# Altium schematic sheet SMPS_LLC.SchDoc
size A3; CheckedBy: Alain.Zhu; CompanyName: TYMPHANY; DrawnBy: Yetta.He; Organization: PABU-BL3; Address1: 11F,block A, CEC building,; Address2: No.2070 Shennan Zhong road,; Address3: Huaqiang North, Futian District,; Address4: Shenzhen,  Guang Dong, P.R.C 518000; DocumentNumber: 3; Revision: 1.0.0; SheetNumber: 3; SheetTotal: 8; Size: A3; PCB By: Yetta.He; Status: DP1.1
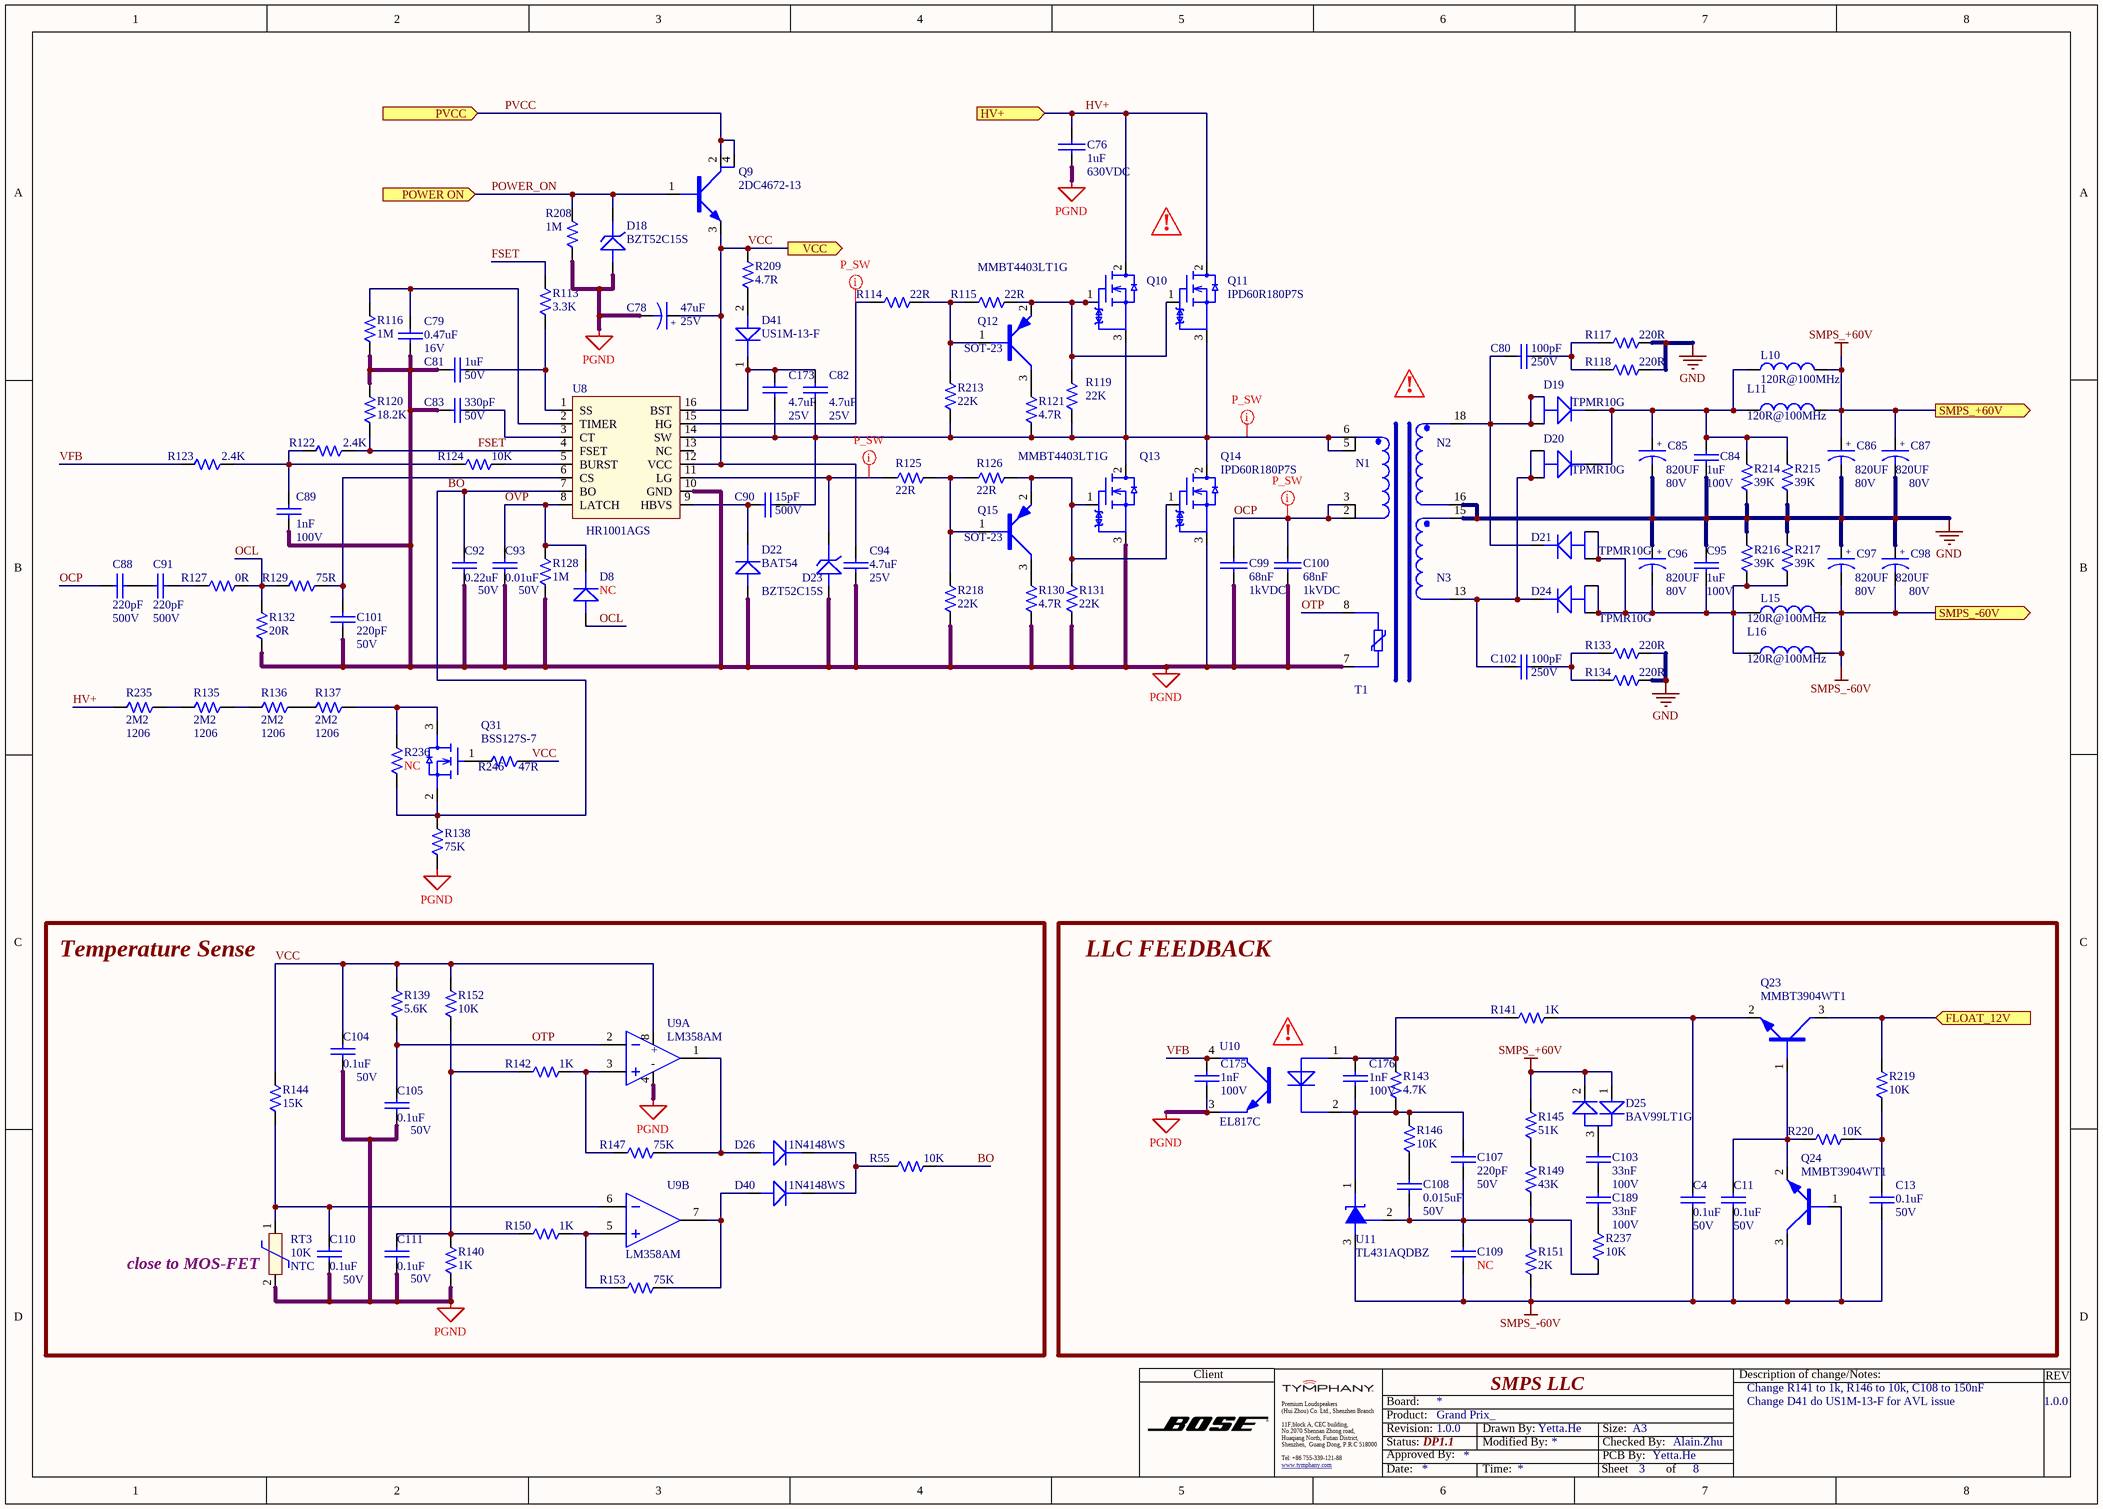
[diagram p0: SMPS_LLC.SchDoc]

## Parts
(Parts that share a designator on the sheet are numbered #1, #2 ... from top to bottom, then left to right.)
*?#1  Important Sign  (value not drawn)  (graphical)
*?#2  Important Sign  (value not drawn)  (graphical)
*?#3  Important Sign  (value not drawn)  (graphical)
C4  value 0.1uF  Voltage: 50V  [CAPC0603-RW]  (hidden comment: PXL456470-1040)
C11  value 0.1uF  Voltage: 50V  [CAPC0603-RW]  (hidden comment: PXL456470-1040)
C13  value 0.1uF  Voltage: 50V  [CAPC0603-RW]  (hidden comment: PXL456470-1040)
C76  value 1uF  Voltage: 630VDC  [CAP_NP_T11L18H18.5P15]  (hidden comment: T564105317010)
C78  value 47uF  Voltage: 25V  [CASE - D8]  (hidden comment: T551470445040)
C79  value 0.47uF  Voltage: 16V  [CAPC0603-RW]  (hidden comment: T542024747305)
C80  value 100pF  Voltage: 250V  [CAPC0805-RW]  (hidden comment: PYL4103F0-1010)
C81  value 1uF  Voltage: 50V  [CAPC0603-RW]  (hidden comment: T542021057508)
C82  value 4.7uF  Voltage: 25V  [CAPC0603-RW]  (hidden comment: T542024757408)
C83  value 330pF  Voltage: 50V  [CAPC0603-RW]  (hidden comment: PXL410370-3310)
C84  value 1uF  Voltage: 100V  [CAPC0805X125N-RW]  (hidden comment: T54000000644C)
C85  value 820UF  Voltage: 80V  [CAP_Radial_D18L25P7.5]  (hidden comment: T5528214C4010)
C86  value 820UF  Voltage: 80V  [CAP_Radial_D18L25P7.5]  (hidden comment: T5528214C4010)
C87  value 820UF  Voltage: 80V  [CAP_Radial_D18L25P7.5]  (hidden comment: T5528214C4010)
C88  value 220pF  Voltage: 500V  [CAPC0805-RW]  (hidden comment: T542032217908)
C89  value 1nF  Voltage: 100V  [CAPC0603-RW]  (hidden comment: PXL4564A2-1020)
C90  value 15pF  Voltage: 500V  [CAPC1206-RW]  (hidden comment: T541041506908)
C91  value 220pF  Voltage: 500V  [CAPC0805-RW]  (hidden comment: T542032217908)
C92  value 0.22uF  Voltage: 50V  [CAPC0603-RW]  (hidden comment: PXL456470-2240)
C93  value 0.01uF  Voltage: 50V  [CAPC0603-RW]  (hidden comment: T541021036508)
C94  value 4.7uF  Voltage: 25V  [CAPC0603-RW]  (hidden comment: T542024757408)
C95  value 1uF  Voltage: 100V  [CAPC0805X125N-RW]  (hidden comment: T54000000644C)
C96  value 820UF  Voltage: 80V  [CAP_Radial_D18L25P7.5]  (hidden comment: T5528214C4010)
C97  value 820UF  Voltage: 80V  [CAP_Radial_D18L25P7.5]  (hidden comment: T5528214C4010)
C98  value 820UF  Voltage: 80V  [CAP_Radial_D18L25P7.5]  (hidden comment: T5528214C4010)
C99  value 68nF  Voltage: 1kVDC  [CAP_NP_RADIAL_T9.0L18H17.5P15]  (hidden comment: T564683216010)
C100  value 68nF  Voltage: 1kVDC  [CAP_NP_RADIAL_T9.0L18H17.5P15]  (hidden comment: T564683216010)
C101  value 220pF  Voltage: 50V  [CAPC0603-RW]  (hidden comment: T541022216505)
C102  value 100pF  Voltage: 250V  [CAPC0805-RW]  (hidden comment: PYL4103F0-1010)
C103  value 33nF  Voltage: 100V  [CAPC0805-RW]  (hidden comment: PYL4564A1-3330)
C104  value 0.1uF  Voltage: 50V  [CAPC0603-RW]  (hidden comment: PXL456470-1040)
C105  value 0.1uF  Voltage: 50V  [CAPC0603-RW]  (hidden comment: PXL456470-1040)
C107  value 220pF  Voltage: 50V  [CAPC0603-RW]  (hidden comment: T541022216505)
C108  value 0.015uF  Voltage: 50V  [CAPC0603-RW]  (hidden comment: PXL456470-1530)
C109  value NC  [CAPC0603-RW]  (hidden comment: CAP0603 NC)
C110  value 0.1uF  Voltage: 50V  [CAPC0603-RW]  (hidden comment: PXL456470-1040)
C111  value 0.1uF  Voltage: 50V  [CAPC0603-RW]  (hidden comment: PXL456470-1040)
C173  value 4.7uF  Voltage: 25V  [CAPC0603-RW]  (hidden comment: T542024757408)
C175  value 1nF  Voltage: 100V  [CAPC0603-RW]  (hidden comment: PXL4564A2-1020)
C176  value 1nF  Voltage: 100V  [CAPC0603-RW]  (hidden comment: PXL4564A2-1020)
C189  value 33nF  Voltage: 100V  [CAPC0805-RW]  (hidden comment: PYL4564A1-3330)
D8  MFG Part: NC  [SOD-323]  (hidden comment: RCD114148-0020)
D18  MFG Part: BZT52C15S  [SOD-323]  (hidden comment: T573004480941)
D19  T572005781008  [TO-277A (SMPC)]  (value not drawn)
D20  T572005781008  [TO-277A (SMPC)]  (value not drawn)
D21  T572005781008  [TO-277A (SMPC)]  (value not drawn)
D22  RCD100540-0040  [SOT23-132-RW]  (value not drawn)
D23  MFG Part: BZT52C15S  [SOD-323]  (hidden comment: T573004480941)
D24  T572005781008  [TO-277A (SMPC)]  (value not drawn)
D25  RCD100099-0010  [SOT23-132-RW]  (value not drawn)
D26  RCD114148-0020  [SOD-323]  (value not drawn)
D40  RCD114148-0020  [SOD-323]  (value not drawn)
D41  RCD100010-0030  [SMA(DO-214AC)]  (value not drawn)
L10  value 120R@100MHz  [L1812(4532)]  (hidden comment: T710500015400)
L11  value 120R@100MHz  [L1812(4532)]  (hidden comment: T710500015400)
L15  value 120R@100MHz  [L1812(4532)]  (hidden comment: T710500015400)
L16  value 120R@100MHz  [L1812(4532)]  (hidden comment: T710500015400)
Q9  MFG Part: 2DC4672-13  [SOT89]  (hidden comment: T581004240538)
Q10  IPD60R180P7S  [DPAK-3]  (value not drawn)
Q11  IPD60R180P7S  [DPAK-3]
Q12  Package: SOT-23  [SOT23-132-RW]  (hidden comment: T582003100440)
Q13  IPD60R180P7S  [DPAK-3]  (value not drawn)
Q14  IPD60R180P7S  [DPAK-3]
Q15  Package: SOT-23  [SOT23-132-RW]  (hidden comment: T582003100440)
Q23  T581003992440  [SOT323(SC-70)-R]  (value not drawn)
Q24  T581003992440  [SOT323(SC-70)-R]  (value not drawn)
Q31  MFG Part: BSS127S-7  [SOT23-132-RW]  (hidden comment: T586003760438)
R55  value 10K  [0603-RW]  (hidden comment: QCF011030-1002)
R113  value 3.3K  [0603-RW]  (hidden comment: QCF011030-3301)
R114  value 22R  [0603-RW]  (hidden comment: QCF011030-2209)
R115  value 22R  [0603-RW]  (hidden comment: QCF011030-2209)
R116  value 1M  [0603-RW]  (hidden comment: QCF011030-1004)
R117  value 220R  [1206-RW]  (hidden comment: QCF041011-2200)
R118  value 220R  [1206-RW]  (hidden comment: QCF041011-2200)
R119  value 22K  [0603-RW]  (hidden comment: QCF011030-2202)
R120  value 18.2K  [0603-RW]  (hidden comment: QCF011030-1822)
R121  value 4.7R  [0805-RW]  (hidden comment: QCF081020-4708)
R122  value 2.4K  [0603-RW]  (hidden comment: QCF011030-2401)
R123  value 2.4K  [0603-RW]  (hidden comment: QCF011030-2401)
R124  value 10K  [0603-RW]  (hidden comment: QCF011030-1002)
R125  value 22R  [0603-RW]  (hidden comment: QCF011030-2209)
R126  value 22R  [0603-RW]  (hidden comment: QCF011030-2209)
R127  value 0R  [0805-RW]  (hidden comment: T502000003009)
R128  value 1M  [0603-RW]  (hidden comment: QCF011030-1004)
R129  value 75R  [0603-RW]  (hidden comment: QCF011030-7509)
R130  value 4.7R  [0805-RW]  (hidden comment: QCF081020-4708)
R131  value 22K  [0603-RW]  (hidden comment: QCF011030-2202)
R132  value 20R  [0603-RW]  (hidden comment: QCF011030-2009)
R133  value 220R  [1206-RW]  (hidden comment: QCF041011-2200)
R134  value 220R  [1206-RW]  (hidden comment: QCF041011-2200)
R135  value 2M2  PACKAGE: 1206  [1206-RW]  (hidden comment: T502220404399)
R136  value 2M2  PACKAGE: 1206  [1206-RW]  (hidden comment: T502220404399)
R137  value 2M2  PACKAGE: 1206  [1206-RW]  (hidden comment: T502220404399)
R138  value 75K  [0603-RW]  (hidden comment: QCF011030-7502)
R139  value 5.6K  [0603-RW]  (hidden comment: QCF011030-5601)
R140  value 1K  [0603-RW]  (hidden comment: QCF011030-1001)
R141  value 1K  [0603-RW]  (hidden comment: QCF011030-1001)
R142  value 1K  [0603-RW]  (hidden comment: QCF011030-1001)
R143  value 4.7K  [0603-RW]  (hidden comment: QCF011030-4701)
R144  value 15K  [0603-RW]  (hidden comment: QCF011030-1502)
R145  value 51K  [0603-RW]  (hidden comment: QCF011030-5102)
R146  value 10K  [0603-RW]  (hidden comment: QCF011030-1002)
R147  value 75K  [0603-RW]  (hidden comment: QCF011030-7502)
R149  value 43K  [0603-RW]  (hidden comment: QCF011031-4302)
R150  value 1K  [0603-RW]  (hidden comment: QCF011030-1001)
R151  value 2K  [0603-RW]  (hidden comment: QCF011030-2001)
R152  value 10K  [0603-RW]  (hidden comment: QCF011030-1002)
R153  value 75K  [0603-RW]  (hidden comment: QCF011030-7502)
R208  value 1M  [0603-RW]  (hidden comment: QCF011030-1004)
R209  value 4.7R  [0805-RW]  (hidden comment: QCF081020-4708)
R213  value 22K  [0603-RW]  (hidden comment: QCF011030-2202)
R214  value 39K  [0805-RW]  (hidden comment: QCF081020-3902)
R215  value 39K  [0805-RW]  (hidden comment: QCF081020-3902)
R216  value 39K  [0805-RW]  (hidden comment: QCF081020-3902)
R217  value 39K  [0805-RW]  (hidden comment: QCF081020-3902)
R218  value 22K  [0603-RW]  (hidden comment: QCF011030-2202)
R219  value 10K  [0603-RW]  (hidden comment: QCF011030-1002)
R220  value 10K  [0603-RW]  (hidden comment: QCF011030-1002)
R235  value 2M2  PACKAGE: 1206  [1206-RW]  (hidden comment: T502220404399)
R236  value NC  [0603-RW]  (hidden comment: RES0603 NC)
R237  value 10K  [0603-RW]  (hidden comment: QCF011030-1002)
R246  value 47R  [0603-RW]  (hidden comment: QCF011030-4709)
RT3  value 10K  Type: NTC  [0603]  (hidden comment: RNT000030-1002)
T1  TRANSF +/-64V  [TRANSF]  (value not drawn)
U8  T610000066055  [SO16]  (value not drawn)
U9  RCI000358-0001  [SO8]  (value not drawn)  (parts A,B of 2)
U10  MFG Part: EL817C  [EL817-S1]  (hidden comment: RCI000817-0001)
U11  MFG Part: TL431AQDBZ  [SOT23-132-RW]  (hidden comment: T610600097805)

## Blocks framed on the sheet
Temperature Sense: C104 C105 C110 C111 D26 D40 R55 R139 R140 R142 R144 R147 R150 R152 R153 RT3 U9
LLC FEEDBACK: *?#3 C4 C11 C13 C103 C107-C109 C175 C176 C189 D25 Q23 Q24 R141 R143 R145 R146 R149 R151 R219 R220 R237 U10 U11

## Ports
FLOAT_12V (in), HV+ (in), POWER ON (in), PVCC (in), SMPS_+60V (out), SMPS_-60V (out), VCC (out)

## Nets
GND: C84.2 C85.2 C86.2 C87.2 C95.1 C96.1 C97.1 C98.1 R117.2 R118.2 R133.2 R134.2 R214.1 R215.1 R216.2 R217.2 T1.15 T1.16
PGND: C76.2 C78.2 C79.1 C81.1 C83.1 C89.2 C92.2 C93.2 C94.2 C99.2 C100.2 C101.2 C104.1 C105.1 C110.1 C111.1 C175.1 D18.1(A) D22.1(A) D23.1(A) Q13.3(D) Q14.3(D) R116.1 R120.2 R128.1 R130.1 R131.1 R132.1 R138.1 R140.1 R208.1 R218.1 RT3.2 T1.7 U8.10(GND) U9.4 U10.3(C)
SMPS_+60V: C86.1 C87.1 D25.1(A) D25.2(A) L10.2 L11.2 R145.2 ; port SMPS_+60V
SMPS_-60V: C4.1 C11.1 C13.1 C97.2 C98.2 C109.2 L15.2 L16.2 Q24.1(B) Q24.3(C) R151.2 U11.3(A) ; port SMPS_-60V
BO: C92.1 Q31.2(G) R55.2 R138.2 R236.1 U8.7(BO)
FLOAT_12V: Q23.3(C) R219.2 ; port FLOAT_12V
FSET: R113.2 R120.1 R122.1 U8.4(FSET)
HV+: C76.1 Q10.2(S) Q11.2(S) R235.2 ; port HV+
OCL: D8.1(A) R127.2 R129.2 R132.2
OCP: C88.2 C99.1 C100.1 T1.2 T1.3
OTP: C105.2 R139.1 T1.8 U9.2(IN-)
OVP: C93.1 D8.2(K) R128.2 U8.8(LATCH)
POWER_ON: D18.2(K) Q9.1(B) R208.2 ; port POWER ON
PVCC: Q9.2(C) Q9.4 ; port PVCC
VCC: C78.1 C94.1 C104.2 Q9.3(E) R139.2 R144.2 R152.2 R209.2 R246.1 U8.12(VCC) U9.8 ; port VCC
VFB: C175.2 R123.2 U10.4(C)
NetC4_2: C4.2 Q23.2(E) R141.2
NetC11_2: C11.2 Q23.1(B) Q24.2(E) R220.1
NetC13_2: C13.2 R219.1 R220.2
NetC79_2: C79.2 R116.2 U8.2(TIMER)
NetC80_1: C80.1 D19.1(A1) D19.2(A2) D21.3(K) T1.18
NetC80_2: C80.2 R117.1 R118.1
NetC81_2: C81.2 R113.1 U8.1(SS)
NetC82_1: C82.1 C173.1 D41.1(A) U8.16(BST)
NetC82_2: C82.2 C90.2 C173.2 Q10.3(D) Q11.3(D) Q13.2(S) Q14.2(S) R119.1 R121.1 R213.1 T1.5 T1.6 U8.14(SW)
NetC83_2: C83.2 U8.3(CT)
NetC84_1: C84.1 C85.1 D19.3(K) D20.3(K) L10.1 L11.1 R214.2 R215.2
NetC88_1: C88.1 C91.2
NetC89_1: C89.1 R122.2 R123.1 R124.1
NetC90_1: C90.1 D22.3(K) U8.9(HBVS)
NetC91_1: C91.1 R127.1
NetC95_2: C95.2 C96.2 D21.1(A1) D21.2(A2) D24.1(A1) D24.2(A2) L15.1 L16.1 R216.1 R217.1
NetC101_1: C101.1 R129.1 U8.6(CS)
NetC102_1: C102.1 D20.1(A1) D20.2(A2) D24.3(K) T1.13
NetC102_2: C102.2 R133.1 R134.1
NetC103_1: C103.1 D25.3(K)
NetC103_2: C103.2 C189.1
NetC107_1: C107.1 C176.1 R143.1 R146.2 U10.2(E) U11.1(K)
NetC107_2: C107.2 C108.2 C109.1 R149.1 R151.1 R237.1 U11.2(R)
NetC108_1: C108.1 R146.1
NetC110_2: C110.2 R144.1 RT3.1 U9.6(IN-)
NetC111_2: C111.2 R140.2 R142.1 R150.1 R152.1
NetC176_2: C176.2 R141.1 R143.2 U10.1(B)
NetC189_2: C189.2 R237.2
NetD23_2: D23.2(K) R125.1 U8.11(LG)
NetD26_1: D26.1(A) R147.2 U9.1(OUT)
NetD26_2: D26.2(K) D40.2(K) R55.1
NetD40_1: D40.1(A) R153.2 U9.7(OUT)
NetD41_2: D41.2(K) R209.1
NetQ10_1: Q10.1(G) Q11.1(G) Q12.2(E) R115.2 R119.2
NetQ12_1: Q12.1(B) R114.2 R115.1 R213.2
NetQ12_3: Q12.3(C) R121.2
NetQ13_1: Q13.1(G) Q14.1(G) Q15.2(E) R126.2 R131.2
NetQ15_1: Q15.1(B) R125.2 R126.1 R218.2
NetQ15_3: Q15.3(C) R130.2
NetQ31_1: Q31.1(S) R246.2
NetQ31_3: Q31.3(D) R137.1 R236.2
NetR114_1: R114.1 U8.15(HG)
NetR124_2: R124.2 U8.5(BURST)
NetR135_1: R135.1 R136.2
NetR135_2: R135.2 R235.1
NetR136_1: R136.1 R137.2
NetR142_2: R142.2 R147.1 U9.3(IN+)
NetR145_1: R145.1 R149.2
NetR150_2: R150.2 R153.1 U9.5(IN+)

Not connected (* = marked no-connect by the designer): U8 13(NC)

## Layout directives
net class P_SW: NetC82_2, NetD23_2, NetR114_1, OCP

## Notes on the sheet
- (near RT3) close to MOS-FET
- SMPS LLC
- Change R141 to 1k, R146 to 10k, C108 to 150nF
- Change D41 do US1M-13-F for AVL issue
- Client
- Description of change/Notes:
- REV
- Premium Loudspeakers
- (Hui Zhou) Co. Ltd., Shenzhen Branch
- Tel: +86 755-339-121-88
- Board:
- Status:
- Revision:
- Product:
- Approved By:
- Grand Prix_
- Drawn By:
- Modified By:
- Checked By:
- PCB By:
- Size:
- www.tymphany.com <http://www.tymphany.com>
- Date:
- Time:
- Sheet
- of
- (in symbol CAP E 47UF 25V +-20%_OVK470M1ETR-0608CS) +
- (in symbol CAP E 820UF 80V +-20% _D18L25P7.5_NIPPON-KZN) +
- (in symbol Important Sign) !
- (in symbol LM358AM, part A) +; -
- (in symbol TRANSF +/-64V) N2; N1; N3

## Library data of the parts
C4 C11 C13 C104 C105 C110 C111 = CAP0603 0.1uF 50V 10% - PXL456470-1040: GP CHIP CAP 0.1uF 50V 10% 0603 TYPE X7R; SAP: T542021047508; Vendor Code: 10010262; Vendor Name: 东莞市晴远电子有限公司; Type: Capacitor; DIP&SMD: SMD; PACKAGE: CAPC0603; MFG: *; MFG Part: *; Other: X7R; Tolerance: 10%; Customer Specific: N/A
C76 = CAP E METAL 1uF 630VDC 10% - TDK_MKP_B32672P: PLS-DIP 1UF 630V +-10% W B32672P6 K; MFG Part: B32672P6105K; MFG: Epcos(TDK); Tolerance: 10%; Type: Capacitor; CREATE_NAME: Nathan; DIP&SMD: DIP; SAP: T564105317010; PACKAGE: 1uF/630VDC; Vendor Name: *; Vendor Code: *; CREATE_TIME: 12-Nov-2018; Customer Specific: N/A
C78 = CAP E 47UF 25V +-20%_OVK470M1ETR-0608CS: E 47UF 25V +-20% 6X8MM OVK470M1E K; MFG: LELON; Tolerance: 20%; Type: Capacitor; CREATE_NAME: Cherry; DIP&SMD: SMD; SAP: T551470445040; PACKAGE: CASE - C7.7; Vendor Name: *; Vendor Code: *; MFG Part: OVK470M1ETR-0608CS; Other: *; CREATE_TIME: 2019-04-02; Customer Specific: N/A
C79 = CAP0603 0.47uF 16V 10%_X7R_MURATA: CAP X7R .47UF 16V +-10% 0603 MURATA L; Tolerance: 10%; Type: Capacitor; CREATE_NAME: Nathan; DIP&SMD: SMD; SAP: T542024747305; PACKAGE: CAPC0603; Vendor Name: *; MFG: MURATA; MFG Part: *; Other: X7R; CREATE_TIME: 02-Aug-2016; Customer Specific: N/A
C80 C102 = CAP0805 100pF 250V 5%: CHIP CAP  100pF 250V 5% 0805 NPO; SAP: T541031016G08; Vendor Code: 10010262; Vendor Name: 东莞市晴远电子有限公司; Type: Capacitor; PACKAGE: CAPC0805; MFG: *; MFG Part: *; Other: NPO; Tolerance: 5%
C81 = CAP0603 1uF 50V 10%_X7R_WALSIN: CAP X7R 1.0UF 50V +-10% 0603 WALSIN L; Tolerance: 10%; Type: Capacitor; CREATE_NAME: Nathan; DIP&SMD: SMD; SAP: T542021057508; PACKAGE: CAPC0603; Vendor Name: *; MFG: WALSIN; MFG Part: *; Other: X7R; CREATE_TIME: 13-July-2016; Customer Specific: N/A
C82 C94 C173 = CAP0603 4.7uF 25V 10%_X7R_WALSIN: CAP X7R 4.7UF 25V +-10% 0603 WALSIN L; Tolerance: 10%; Type: Capacitor; CREATE_NAME: Nathan; DIP&SMD: SMD; SAP: T542024757408; PACKAGE: CAPC0603; Vendor Name: *; MFG: WALSIN; MFG Part: *; Other: X7R; CREATE_TIME: 13-July-2016; Customer Specific: N/A
C83 = CAP0603 330pF 50V 5%: GP CHIP CAP 330pF 50V 5%; SAP: T541023316508; Vendor Code: 10010262; Vendor Name: 东莞市晴远电子有限公司; Type: Capacitor; DIP&SMD: SMD; PACKAGE: CAPC0603; MFG: *; MFG Part: *; Other: *; Tolerance: 5%; Customer Specific: N/A
C84 C95 = CAPC0805 1uF 100V 10%_X7S_TDK: CAP 1.0UF 100V +-10% 0805X7S TDK L; Other: X7S; Tolerance: 10%; Type: Capacitor; CREATE_NAME: Nathan; DIP&SMD: SMD; SAP: T54000000644C; PACKAGE: CAPC0805; Vendor Code: *; Vendor Name: *; MFG: TDK; MFG Part: *; CREATE_TIME: 06-Aug-2016; Customer Specific: N/A
C85-C87 C96-C98 = CAP E 820UF 80V +-20% _D18L25P7.5_NIPPON-KZN: E 820UF 80V +-20% D18*L2 EKZN800EL K; MFG Part: EKZN800ELL821MM25S; MFG: NIPPON; Type: Capacitor; DIP&SMD: DIP; Tolerance: 20%; SAP: T5528214C4010; PACKAGE: 820uF/80V; Customer Specific: N/A; Vendor Name: *; Vendor Code: *; Other: *; CREAT NAME: 2019-04-09
C88 C91 = CAPC0805 220pF 500V 10%_X7R_WALSIN: CAP X7R 220PF 500V +-10% 0805 WALSIN L; Tolerance: 10%; Type: Capacitor; CREATE_NAME: Nathan; DIP&SMD: SMD; SAP: T542032217908; PACKAGE: CAPC0805; Vendor Code: *; Vendor Name: *; MFG: WALSIN; MFG Part: *; Other: X7R; CREATE_TIME: 06-Aug-2016; Customer Specific: N/A
C89 C175 C176 = CAP0603 1nF 100V 10% - PXL4564A2-1020: CHIP CAP 1nF 100V 10%; SAP: T542021027608; Vendor Code: 10010262; Vendor Name: 东莞市晴远电子有限公司; Type: Capacitor; DIP&SMD: SMD; PACKAGE: CAPC0603; MFG: *; MFG Part: *; Other: *; Tolerance: 10%; Customer Specific: N/A
C90 = CAP1206 15pF 500V 5%_NPO_WALSIN: CAP NPO 15PF 500V +-5% 1206 WALSIN L; MFG: WALSIN (華新); Tolerance: 5%; Type: Capacitor; CREATE_NAME: Nathan; DIP&SMD: SMD; SAP: T541041506908; PACKAGE: CAPC1206; Vendor Code: *; Vendor Name: *; MFG Part: *; Other: NPO; CREATE_TIME: 06-Aug-2016; Customer Specific: N/A
C92 = CAP0603 0.22uF 50V 10% - PXL456470-2240: CHIP CAP 0.22uF 50V 10% 0603 X7R; SAP: T542022247508; Vendor Code: 10010262; Vendor Name: 东莞市晴远电子有限公司; Type: Capacitor; DIP&SMD: SMD; PACKAGE: CAPC0603; MFG: *; MFG Part: *; Other: X7R; Tolerance: 10%; Customer Specific: N/A
C93 = CAP0603 0.01uF 50V 5%_NPO_WALSIN: CAP NPO .01UF 50V +-5% 0603 WALSIN L; Tolerance: 5%; Type: Capacitor; DIP&SMD: SMD; CREATE_NAME: Nathan; SAP: T541021036508; PACKAGE: CAPC0603; Vendor Name: *; MFG: WALSIN; MFG Part: *; Other: NPO; Customer Specific: N/A; CREATE_TIME: 13-July-2016
C99 C100 = CAP E METAL 68nF 1kVDC 10% - TDK_MMKP_B32642B: PLS-DIP 0.068U 1KV +-5% W B32642B K; MFG Part: B32642B0683J000; MFG: Epcos(TDK); Tolerance: 10%; Type: Capacitor; CREATE_NAME: Nathan; DIP&SMD: DIP; SAP: T564683216010; PACKAGE: 68nF/1kVDC; Vendor Name: *; Vendor Code: *; CREATE_TIME: 12-Nov-2018; Customer Specific: N/A
C101 C107 = CAP0603 220pF 50V 5%_NPO_MURATA: CAP NPO 220PF 50V +-5% 0603 MURATA L; Tolerance: 5%; Type: Capacitor; CREATE_NAME: Nathan; DIP&SMD: SMD; SAP: T541022216505; PACKAGE: CAPC0603; Vendor Name: *; MFG: MURATA; MFG Part: *; Other: NPO; CREATE_TIME: 02-Aug-2016; Customer Specific: N/A
C103 C189 = CAP0805 33nF 100V 10%: CHIP CAP 33nF 100V 10% 0805 TYPE X7R; SAP: T542033337608; MFG: Walsin; Type: Capacitor; DIP&SMD: SMD; PACKAGE: CAPC0805; Vendor Code: *; Vendor Name: *; MFG Part: *; Other: X7R; Tolerance: 10%; Customer Specific: N/A
C108 = CAP0603 0.015uF 50V 10%: GP CHIP CAP 0.015uF 50V 10% 0603 TYPE X7R; SAP: T542021537508; Vendor Code: 10010262; Vendor Name: 东莞市晴远电子有限公司; Type: Capacitor; DIP&SMD: SMD; PACKAGE: CAPC0603; MFG: *; MFG Part: *; Other: X7R; Tolerance: 10%; Customer Specific: N/A
C109 = CAP0603 NC: NC; Type: Capacitor; CREATE_NAME: Tom; DIP&SMD: SMD; SAP: *; PACKAGE: CAPC0603; Vendor Code: *; Vendor Name: *; MFG: *; MFG Part: *; Other: *; Tolerance: *; CREATE_TIME: 18-Mar-2016; Voltage: *; Customer Specific: N/A
D8 D26 D40 = 1N4148WS: DIODE SW 1N4148 VF=0.7V SOD-323; MFG: TW SEMICONDUCTOR; SAP: T572005070208; Voltage: 100V; Current: 150MA; DIP&SMD: SMD; Vendor Name: *; Vendor Code: *; Type: DIODE; Package: SOD-323; Customer Specific: N/A
  D26 D40: MFG Part: 1N4148WS
D18 D23 = BZT52C15S_TSC: ZD 15V 200MW ±5% SMD TSC ( K; MFG: TSC (TAIWAN SEMICONDUCTOR); Type: ZENER; CREATE_NAME: Nathan; SAP: T573004480941; Vendor Code: *; Vendor Name: *; Current: *; Tolerance: 5%; Power: 200MW; VOLTAGE: 15V; Package: SOD-323F; CREATE_TIME: 15-Mar-2019; DIP&SMD: SMD; Customer Specific: N/A
D19-D21 D24 = TPMR10G: SWITC 400V 10A TPMR10G TSC K; MFG: TSC    (台灣半導體); Type: DIODE; CREATE_NAME: Nathan; DIP&SMD: SMD; SAP: T572005781008; Vendor Code: *; Vendor Name: *; CREATE_TIME: 17-Jun-2016; Customer Specific: N/A; MFG Part: TPMR10G; Voltage: 400V; Current: 10A
D22 = BAT54: DIODE BAT54 SOT-23; MFG: PANJIT; SAP: T572005020116; Voltage: 30V; Current: 0.2A; CREATE_NAME: GordonL@Deftronics; DIP&SMD: SMD; Vendor Code: *; Vendor Name: *; Type: DIODE; CREATE_TIME: 31-JAN-2013; Customer Specific: N/A; MFG Part: BAT54
D25 = BAV99LT1G: SWITC 70V 215MA BAV99LT1G ON SE G; SAP: T572003550122; MFG: ON SEMI; Voltage: 100V; Power: 225MW; Type: DIODE; Vendor Code: *; Vendor Name: *; Current: 215mA; Package: SOT-23; MFG Part: BAV99LT1G
D41 = US1M-13-F: DIODE 1000 1.0A US1M-13-F DIODE K; MFG: DIODES  (ZETEX); SAP: T571002110230; CREATE_NAME: Nathan; DIP&SMD: SMD; Voltage: *; Type: DIODE; CREATE_TIME: 10-Aug-2017; Customer Specific: N/A; MFG Part: US1M-13-F
L10 L11 L15 L16 = BEAD 1812 120R@100MHz FBMA-11-453215-121A90T: CHIP BEAD 120 OHM 25% 100MHZ 9A 1812 K; MFG: KING CORE; Type: INDUCTOR; DIP&SMD: SMD; SAP: T710500015400; Test Frequency: 100MHZ; Vendor Code: *; Vendor Name: *; Current: 9A; MFG Part: FBMA-11-453215-121A90T
Q9 = NPN 2DC4672-13: NPN 50V 2DC4672-13 SOT89 DIODES K; MFG: DIODES  (ZETEX); Type: NPN transistor; CREATE_NAME: Nathan; DIP&SMD: SMD; SAP: T581004240538; Vendor Name: *; Vendor Code: *; CREATE_TIME: 02-May-2019; Customer Specific: N/A
Q10 Q11 Q13 Q14 = IPD60R180P7S: 600V CoolMOS Power Transistor; MFG: INFINEON; SAP: T586003650350; Type: NMOS; CREATE_NAME: Nathan; Voltage: 650V; Current: 53A; DIP&SMD: SMD; Vendor Code: *; Vendor Name: *; CREATE_TIME: 28-Sep-2018; Package: TO252-3(DPAK); Power: *; Customer Specific: N/A; MFG Part: IPD60R180P7S
Q12 Q15 = MMBT4403LT1G: PNP -40V MMBT4403LT1G SOT23 ON K; Voltage: 40V; DIP&SMD: SMD; Current: 600mA; CREATE NAME: Nathan; SAP: T582003100440; MFG: ON; Vendor Code: *; Vendor Name: *; Type: PNP; Customer Specific: N/A; MFG Part: MMBT4403LT1G; CREATE TIME: 25-Dec-2018
Q23 Q24 = MMBT3904WT1: NPN 40V MMBT3904WT1 SC70 ( ON K; CREATE_NAME: Nathan; DIP&SMD: SMD; SAP: T581003992440; MFG: ON; Vendor Code: *; Vendor Name: *; Voltage: *; Type: NPN; CREATE_TIME: 17-Oct-2017; Current: *; Customer Specific: N/A; MFG Part: MMBT3904WT1
Q31 = NMOS BSS127S-7: NMOS 600V BSS127S-7 SOT23 DIODES K; DIP&SMD: SMD; Current: 70mA; SAP: T586003760438; Power: *; Vendor Code: *; Vendor Name: *; MFG: DIODES; Type: *; Customer Specific: N/A; Package: *; Voltage: 600V; CREAT TIME: 2019-04-09
R55 R124 R146 R152 R219 R220 R237 = RES0603 1/10W 1% 10K OHM: GP CHIP RES. 10K OHM 1/10W 1% 0603; Vendor Code: 10010262; SAP: T502100202399; Vendor Name: 东莞市晴远电子有限公司; DIP&SMD: SMD; Power: 1/10W; MFG Part: *; MFG: *; TOL: 1%; Type: Resistor; PACKAGE: 0603; Customer Specific: N/A
R113 = RES0603 1/10W 1% 3.3K OHM: GP CHIP RES. 3.3K OHM 1/10W 1% 0603; Vendor Code: 10010262; SAP: T502330102399; Vendor Name: 东莞市晴远电子有限公司; DIP&SMD: SMD; Power: 1/10W; MFG Part: *; MFG: *; TOL: 1%; Type: Resistor; PACKAGE: 0603; Customer Specific: N/A
R114 R115 R125 R126 = RES0603 1/10W 1% 22 OHM: GP CHIP RES. 22 OHM 1/10W 1% 0603; Vendor Code: 10010262; SAP: T502220A02399; Vendor Name: 东莞市晴远电子有限公司; DIP&SMD: SMD; Power: 1/10W; MFG Part: *; MFG: *; TOL: 1%; Type: Resistor; PACKAGE: 0603; Customer Specific: N/A
R116 R128 R208 = RES0603 1/10W 1% 1M OHM: GP CHIP RES. 1M OHM 1/10W 1% 0603; Vendor Code: 10010262; SAP: T502100402399; Vendor Name: 东莞市晴远电子有限公司; DIP&SMD: SMD; Power: 1/10W; MFG: *; MFG Part: *; TOL: 1%; Type: Resistor; PACKAGE: 0603; Customer Specific: N/A
R117 R118 R133 R134 = RES1206 1/4W 1% 220 OHM: CHIP RES. 220 OHM 1/4W 1% 1206; Vendor Code: 10010262; SAP: T502220004399; Vendor Name: ¶«Ý¸ÊÐÇçÔ¶µç×ÓÓÐÏÞ¹«Ë¾; DIP&SMD: SMD; Power: 1/4W; MFG Part: *; MFG: *; TOL: 1%; Type: Resistor; PACKAGE: 1206; Customer Specific: N/A
R119 R131 = RES0603 1/10W 1% 22K OHM: GP CHIP RES. 22K OHM 1/10W 1% 0603; Vendor Code: 10010262; SAP: T502220202399; Vendor Name: 东莞市晴远电子有限公司; DIP&SMD: SMD; Power: 1/10W; MFG Part: *; MFG: *; TOL: 1%; Type: Resistor; PACKAGE: 0603; Customer Specific: N/A
R120 = RES0603 1/10W 1% 18.2K OHM: CHIP RES. 18.2K OHM 1/10W 1% 0603; Vendor Code: 10010262; SAP: T502182202399; Vendor Name: 东莞市晴远电子有限公司; DIP&SMD: SMD; Power: 1/10W; MFG Part: *; MFG: *; TOL: 1%; Type: Resistor; PACKAGE: 0603; Customer Specific: N/A
R121 R130 R209 = RES0805 1/8W 1% 4.7 OHM: GP CHIP RES 4.7 OHM 1/8W 1% 0805; Vendor Code: 10010262; SAP: T502470B03399; Vendor Name: 东莞市晴远电子有限公司; DIP&SMD: SMD; Power: 1/8W; MFG Part: *; MFG: *; TOL: 1%; Type: Resistor; PACKAGE: 0805; Customer Specific: N/A
R122 R123 = RES0603 1/10W 1% 2.4K OHM: GP CHIP RES. 2.4K OHM 1/10W 1% 0603; Vendor Code: 10010262; SAP: T502240102399; Vendor Name: 东莞市晴远电子有限公司; DIP&SMD: SMD; Power: 1/10W; MFG Part: *; MFG: *; TOL: 1%; Type: Resistor; PACKAGE: 0603; Customer Specific: N/A
R127 = RES0805 1/8W  0 OHM_WALSIN: CHIP 0 OHM 0 OHM 0 OHM 0805 WALSI L; Power: 1/8W; MFG: WALSIN; CREATE_Name: Tom; DIP&SMD: SMD; Vendor Code: *; SAP: T502000003009; Vendor Name: *; MFG Part: *; TOL: *; Type: Resistor; CREATE_Time: 27-Jun-2018; PACKAGE: 0805; Customer Specific: N/A
R129 = RES0603 1/10W 1% 75 OHM: GP CHIP RES. 75 OHM 1/10W 1% 0603; Vendor Code: 10010262; SAP: T502750A02399; Vendor Name: 东莞市晴远电子有限公司; DIP&SMD: SMD; Power: 1/10W; MFG Part: *; MFG: *; TOL: 1%; Type: Resistor; PACKAGE: 0603; Customer Specific: N/A
R132 = RES0603 1/10W 1% 20 OHM: GP CHIP RES. 20 OHM 1/10W 1% 0603; Vendor Code: 10010262; SAP: T502200A02399; Vendor Name: 东莞市晴远电子有限公司; DIP&SMD: SMD; Power: 1/10W; MFG Part: *; MFG: *; TOL: 1%; Type: Resistor; PACKAGE: 0603; Customer Specific: N/A
R135-R137 R235 = RES1206 1/4W 1% 2.2M OHM_WALSIN: CHIP 2.2M OHM 100PPM +-1% 1206 WALS K; Power: 1/4W; MFG: WALSIN (華新); TOL: 1%; CREATE_NAME: Nathan; DIP&SMD: SMD; Vendor Code: *; SAP: T502220404399; Vendor Name: *; MFG Part: *; Type: Resistor; CREATE_TIME: 13-May-2019; Customer Specific: N/A
R138 R147 R153 = RES0603 1/10W 1% 75K OHM: GP CHIP RES. 75K OHM 1/10W 1% 0603; Vendor Code: 10010262; SAP: T502750202399; Vendor Name: 东莞市晴远电子有限公司; DIP&SMD: SMD; Power: 1/10W; MFG Part: *; MFG: *; TOL: 1%; Type: Resistor; PACKAGE: 0603; Customer Specific: N/A
R139 = RES0603 1/10W 1% 5.6K OHM: GP CHIP RES. 5.6K OHM 1/10W 1% 0603; Vendor Code: 10010262; SAP: T502560102399; Vendor Name: 东莞市晴远电子有限公司; DIP&SMD: SMD; Power: 1/10W; MFG Part: *; MFG: *; TOL: 1%; Type: Resistor; PACKAGE: 0603; Customer Specific: N/A
R140-R142 R150 = RES0603 1/10W 1% 1K OHM: GP CHIP RES. 1K OHM 1/10W 1% 0603; Vendor Code: 10010262; SAP: T502100102399; Vendor Name: 东莞市晴远电子有限公司; DIP&SMD: SMD; Power: 1/10W; MFG Part: *; MFG: *; TOL: 1%; Type: Resistor; PACKAGE: 0603; Customer Specific: N/A
R143 = RES0603 1/10W 1% 4.7K OHM: GP CHIP RES. 4.7K OHM 1/10W 1% 0603; Vendor Code: 10010262; SAP: T502470102399; Vendor Name: 东莞市晴远电子有限公司; DIP&SMD: SMD; Power: 1/10W; MFG: *; MFG Part: *; TOL: 1%; Type: Resistor; PACKAGE: 0603; Customer Specific: N/A
R144 = RES0603 1/10W 1% 15K OHM: GP CHIP RES. 15K OHM 1/10W 1% 0603; Vendor Code: 10010262; SAP: T502150202399; Vendor Name: 东莞市晴远电子有限公司; DIP&SMD: SMD; Power: 1/10W; MFG Part: *; MFG: *; TOL: 1%; Type: Resistor; PACKAGE: 0603; Customer Specific: N/A
R145 = RES0603 1/10W 1% 51K OHM: CHIP RES 51K OHM 1/10W 1% 0603; Vendor Code: 10010262; SAP: T502510202399; Vendor Name: 东莞市晴远电子有限公司; DIP&SMD: SMD; Power: 1/10W; MFG Part: *; MFG: *; TOL: 1%; Type: Resistor; PACKAGE: 0603; Customer Specific: N/A
R149 = RES0603 1/10W 1% 43K OHM: CHIP RES. 43K OHM 1/10W 1% 0603; Vendor Code: 10010262; SAP: T502430202399; Vendor Name: 东莞市晴远电子有限公司; DIP&SMD: SMD; Power: 1/10W; MFG Part: *; MFG: *; TOL: 1%; Type: Resistor; PACKAGE: 0603; Customer Specific: N/A
R151 = RES0603 1/10W 1% 2K OHM: GP CHIP RES. 2K OHM 1/10W 1% 0603; Vendor Code: 10010262; SAP: T502200102399; Vendor Name: 东莞市晴远电子有限公司; DIP&SMD: SMD; Power: 1/10W; MFG: *; MFG Part: *; TOL: 1%; Type: Resistor; PACKAGE: 0603; Customer Specific: N/A
R213 R218 = RES0603 1/10W 1% 22K OHM: GP CHIP RES. 22K OHM 1/10W 1% 0603; Vendor Code: 10010262; SAP: T502220202399; Vendor Name: ¶«Ý¸ÊÐÇçÔ¶µç×ÓÓÐÏÞ¹«Ë¾; DIP&SMD: SMD; Power: 1/10W; MFG Part: *; MFG: *; TOL: 1%; Type: Resistor; PACKAGE: 0603; Customer Specific: N/A
R214-R217 = RES0805 1/8W 1% 39K OHM: GP CHIP RES. 39K OHM 1/8W 1% 0805; Vendor Code: 10010262; SAP: T502390203399; Vendor Name: 东莞市晴远电子有限公司; DIP&SMD: SMD; Power: 1/8W; MFG Part: *; MFG: *; TOL: 1%; Type: Resistor; PACKAGE: 0805; Customer Specific: N/A
R236 = RES0603 NC: NC; CREATE_NAME: Tom; DIP&SMD: SMD; SAP: *; Tolerance: *; MFG Part: *; MFG: *; Vendor Code: *; Vendor Name: *; Type: Resistor; Power: *; CREATE_TIME: 18-Mar-2016; Customer Specific: N/A; Package: 0603
R246 = RES0603 1/10W 1% 47 OHM: GP CHIP RES. 47 OHM 1/10W 1% 0603; Vendor Code: 10010262; SAP: T502470A02399; Vendor Name: 东莞市晴远电子有限公司; DIP&SMD: SMD; Power: 1/10W; MFG Part: *; MFG: *; TOL: 1%; Type: Resistor; PACKAGE: 0603; Customer Specific: N/A
RT3 = NCP18XH103F03RB: NTC 10k Ohm 1%,0603, MURATA; Vendor Code: 10010061; Vendor Name: 深圳市海能达科技发展有限公司; SAP: T710600007400; DIP&SMD: SMD; MFG: Murata; Package: 0603; Customer Specific: N/A; MFG Part: NCP18XH103F03RB
T1 = TRANSF +/-64V: TYPE: TRANSFORMER; DIP&SMD: DIP; Vendor Code: *; Vendor Name: *
U8 = HR1001AGS: SP HR1001AGS SOIC-16 MPS K; CREATE_NAME: Tom; DIP&SMD: SMD; Vendor Code: *; SAP: T610000066055; MFG: MPS; Package: *; Vendor Name: *; Type: IC; CREATE_TIME: 27-Jun-2018; Customer Specific: N/A; MFG Part: HR1001AGS
U9 = LM358AM: IC OP-AMP Dual LM358 DUAL OP-AMP SOIC8; SAP: T610500008001; Vendor Code: 10020355; Vendor Name: SERIAL MICROELECTRONICS (HK) LIMITE; MFG: National SEMI; DIP&SMD: SMD; Type: IC AMP; Customer Specific: N/A; MFG Part: LM358AM
U10 = EL817C-S1: IC 4PIN SMT EL817C  Ever Light; SAP: T58A000491533; Vendor Code: 10020351; Vendor Name: 深圳市卅亿光电有限公司; DIP&SMD: SMD; MFG: Everlight; Type: IC; Customer Specific: N/A
U11 = TL431AQDBZ_TI: REG TL431AQDBZ SOT23-3P TI K; DIP&SMD: SMD; CREATE_NAME: Nathan; SAP: T610600097805; MFG: TI; Vendor Code: *; Vendor Name: *; Type: IC; Customer Specific: N/A; CREATE_TIME: 07-Nov-2018